# Altium schematic sheet Top_Level.SchDoc
size A4
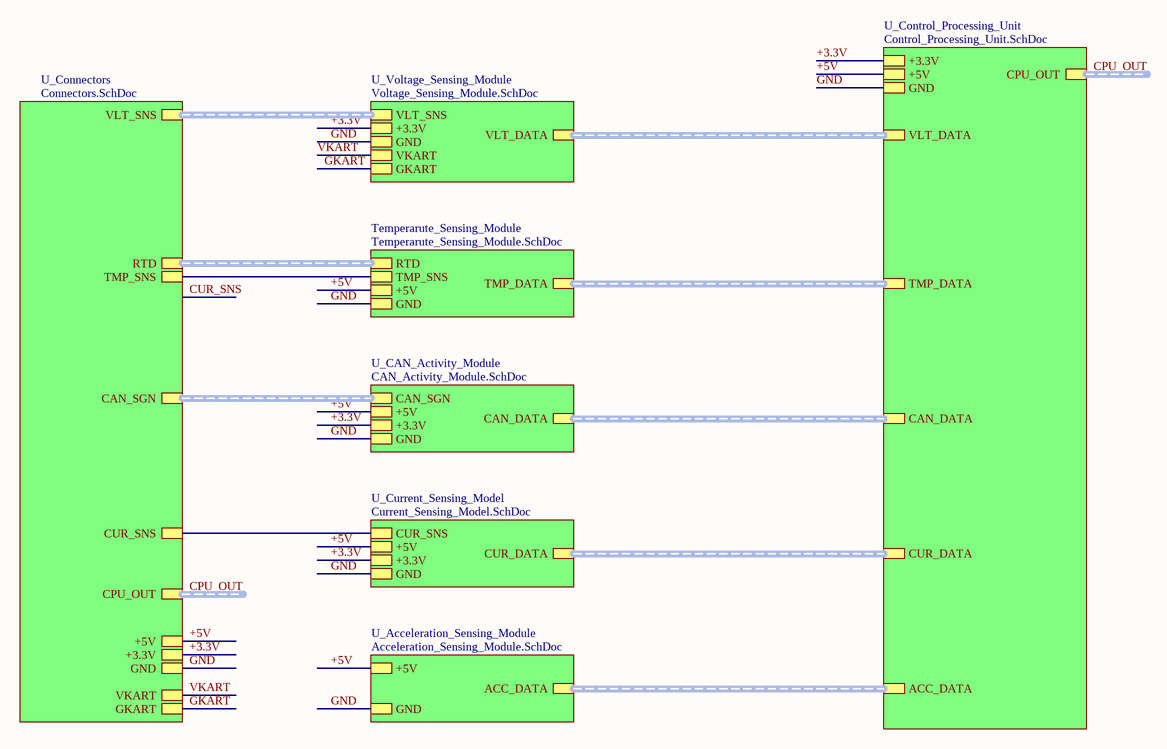
[diagram p0: Top_Level.SchDoc]

## Sub-sheets
Temperarute_Sensing_Module = Temperarute_Sensing_Module.SchDoc: GND, +5V, TMP_DATA (harness TEMP), RTD, TMP_SNS
U_Acceleration_Sensing_Module = Acceleration_Sensing_Module.SchDoc: GND, +5V, ACC_DATA (harness ACCELERATION DATA)
U_CAN_Activity_Module = CAN_Activity_Module.SchDoc: GND, +5V, +3.3V, CAN_DATA (harness CAN DATA), CAN_SGN (harness *)
U_Connectors = Connectors.SchDoc: CUR_SNS, RTD (harness *), TMP_SNS, VLT_SNS (harness VLT SENSE), +5V, +3.3V, GND, GKART, VKART, CAN_SGN (harness CAN SIGNALS), CPU_OUT (harness CPU)
U_Control_Processing_Unit = Control_Processing_Unit.SchDoc: TMP_DATA (harness TEMPERATURE), CUR_DATA (harness CURRENT), ACC_DATA (harness ACCELERATION), CAN_DATA (harness BUS CAN), +3.3V, +5V, GND, VLT_DATA (harness VOLTAGE DATA), CPU_OUT (harness CPU)
U_Current_Sensing_Model = Current_Sensing_Model.SchDoc: GND, +5V, CUR_DATA (harness CURRENT DATA), +3.3V, CUR_SNS
U_Voltage_Sensing_Module = Voltage_Sensing_Module.SchDoc: GND, VLT_DATA (harness VOLTAGE DATA), +3.3V, VKART, GKART, VLT_SNS

## Nets
+3.3V: sheet U_Control_Processing_Unit/+3.3V, sheet U_Current_Sensing_Model/+3.3V, sheet U_CAN_Activity_Module/+3.3V, sheet U_Connectors/+3.3V, sheet U_Voltage_Sensing_Module/+3.3V
+5V: sheet Temperarute_Sensing_Module/+5V, sheet U_Control_Processing_Unit/+5V, sheet U_Acceleration_Sensing_Module/+5V, sheet U_Current_Sensing_Model/+5V, sheet U_CAN_Activity_Module/+5V, sheet U_Connectors/+5V
GKART: sheet U_Connectors/GKART, sheet U_Voltage_Sensing_Module/GKART
GND: sheet Temperarute_Sensing_Module/GND, sheet U_Control_Processing_Unit/GND, sheet U_Acceleration_Sensing_Module/GND, sheet U_Current_Sensing_Model/GND, sheet U_CAN_Activity_Module/GND, sheet U_Connectors/GND, sheet U_Voltage_Sensing_Module/GND
VKART: sheet U_Connectors/VKART, sheet U_Voltage_Sensing_Module/VKART
(unnamed): sheet Temperarute_Sensing_Module/TMP_SNS, sheet U_Connectors/TMP_SNS
(unnamed): sheet U_Current_Sensing_Model/CUR_SNS, sheet U_Connectors/CUR_SNS

## Buses and harness runs
harness CPU_OUT = sheet U_Connectors/CPU_OUT
harness CPU_OUT = sheet U_Control_Processing_Unit/CPU_OUT
harness sheet Temperarute_Sensing_Module/RTD = sheet U_Connectors/RTD
harness sheet Temperarute_Sensing_Module/TMP_DATA = sheet U_Control_Processing_Unit/TMP_DATA
harness sheet U_Acceleration_Sensing_Module/ACC_DATA = sheet U_Control_Processing_Unit/ACC_DATA
harness sheet U_CAN_Activity_Module/CAN_DATA = sheet U_Control_Processing_Unit/CAN_DATA
harness sheet U_CAN_Activity_Module/CAN_SGN = sheet U_Connectors/CAN_SGN
harness sheet U_Connectors/VLT_SNS = sheet U_Voltage_Sensing_Module/VLT_SNS
harness sheet U_Control_Processing_Unit/CUR_DATA = sheet U_Current_Sensing_Model/CUR_DATA
harness sheet U_Control_Processing_Unit/VLT_DATA = sheet U_Voltage_Sensing_Module/VLT_DATA